# Altium schematic sheet FPGA_C.SchDoc: POLYSOME CRYPTO 01
size A3; Revision: V1; SheetNumber: 4; SheetTotal: 8; ProjectName: POLYSOME CRYPTO 01
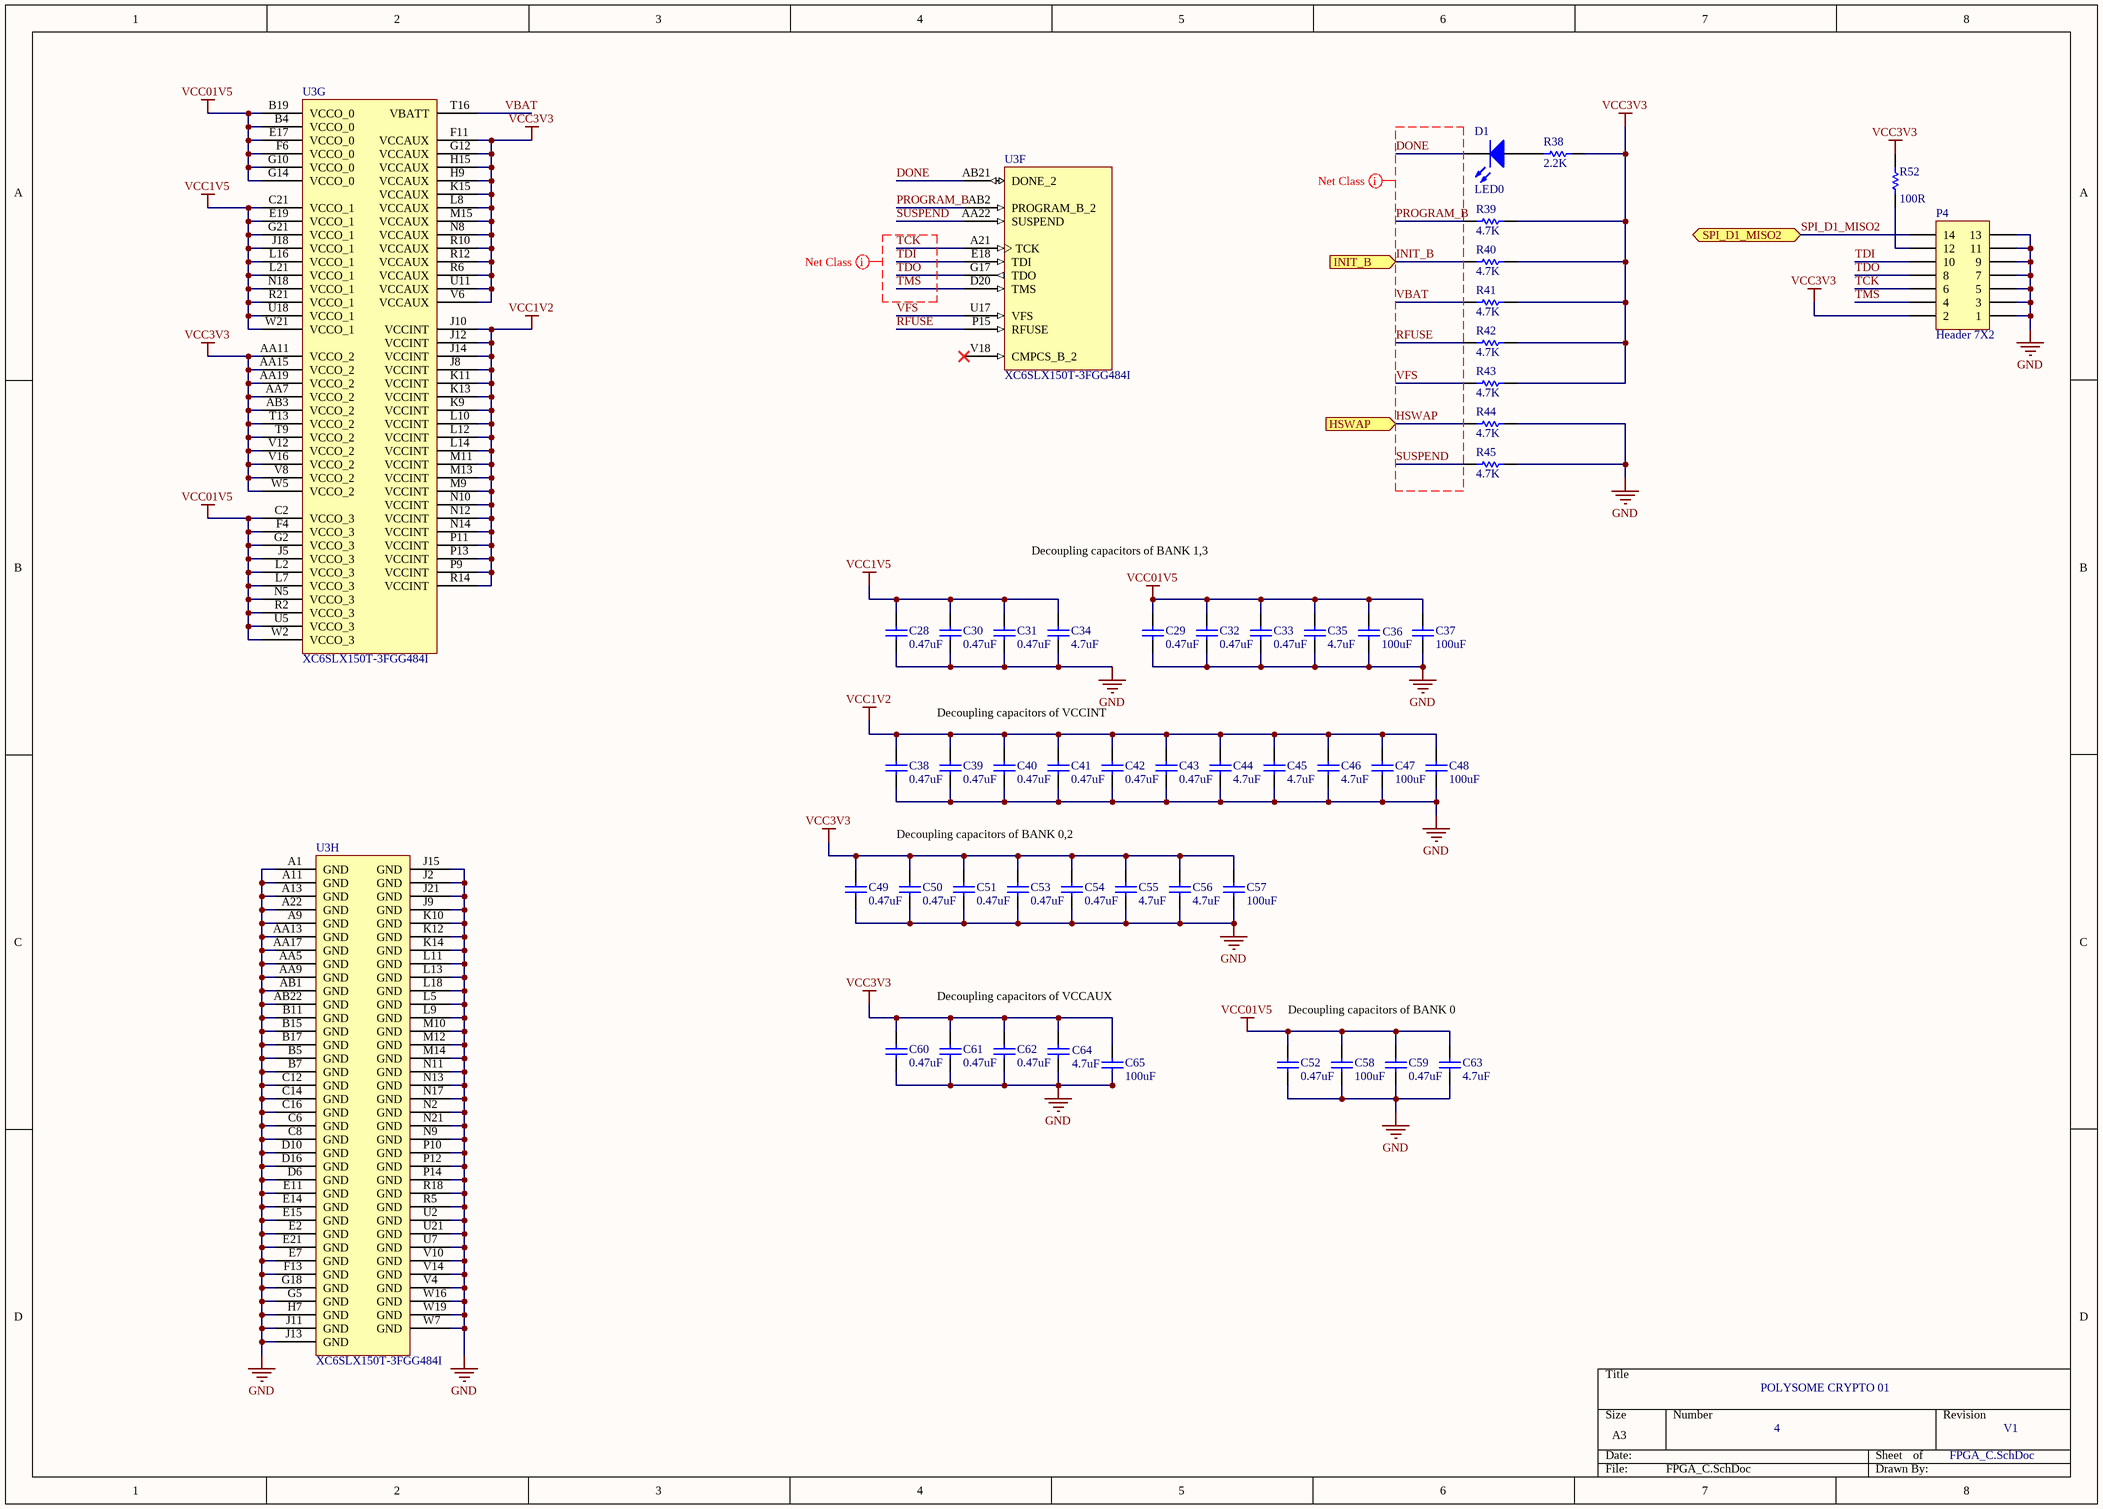
[diagram p0: FPGA_C.SchDoc]

## Parts
C28  value 0.47uF  [0402]  (hidden comment: Cap Semi)
C29  value 0.47uF  [0402]  (hidden comment: Cap Semi)
C30  value 0.47uF  [0402]  (hidden comment: Cap Semi)
C31  value 0.47uF  [0402]  (hidden comment: Cap Semi)
C32  value 0.47uF  [0402]  (hidden comment: Cap Semi)
C33  value 0.47uF  [0402]  (hidden comment: Cap Semi)
C34  value 4.7uF  [1608[0603]]  (hidden comment: Cap Semi)
C35  value 4.7uF  [1608[0603]]  (hidden comment: Cap Semi)
C36  value 100uF  [0402]  (hidden comment: Cap Semi)
C37  value 100uF  [0402]  (hidden comment: Cap Semi)
C38  value 0.47uF  [0402]  (hidden comment: Cap Semi)
C39  value 0.47uF  [0402]  (hidden comment: Cap Semi)
C40  value 0.47uF  [0402]  (hidden comment: Cap Semi)
C41  value 0.47uF  [0402]  (hidden comment: Cap Semi)
C42  value 0.47uF  [0402]  (hidden comment: Cap Semi)
C43  value 0.47uF  [0402]  (hidden comment: Cap Semi)
C44  value 4.7uF  [1608[0603]]  (hidden comment: Cap Semi)
C45  value 4.7uF  [1608[0603]]  (hidden comment: Cap Semi)
C46  value 4.7uF  [1608[0603]]  (hidden comment: Cap Semi)
C47  value 100uF  [0402]  (hidden comment: Cap Semi)
C48  value 100uF  [0402]  (hidden comment: Cap Semi)
C49  value 0.47uF  [0402]  (hidden comment: Cap Semi)
C50  value 0.47uF  [0402]  (hidden comment: Cap Semi)
C51  value 0.47uF  [0402]  (hidden comment: Cap Semi)
C52  value 0.47uF  [0402]  (hidden comment: Cap Semi)
C53  value 0.47uF  [0402]  (hidden comment: Cap Semi)
C54  value 0.47uF  [0402]  (hidden comment: Cap Semi)
C55  value 4.7uF  [1608[0603]]  (hidden comment: Cap Semi)
C56  value 4.7uF  [1608[0603]]  (hidden comment: Cap Semi)
C57  value 100uF  [0402]  (hidden comment: Cap Semi)
C58  value 100uF  [0402]  (hidden comment: Cap Semi)
C59  value 0.47uF  [0402]  (hidden comment: Cap Semi)
C60  value 0.47uF  [0402]  (hidden comment: Cap Semi)
C61  value 0.47uF  [0402]  (hidden comment: Cap Semi)
C62  value 0.47uF  [0402]  (hidden comment: Cap Semi)
C63  value 4.7uF  [1608[0603]]  (hidden comment: Cap Semi)
C64  value 4.7uF  [1608[0603]]  (hidden comment: Cap Semi)
C65  value 100uF  [C1206]  (hidden comment: Cap Semi)
D1  LED0  [1608[0603]]
P4  Header 7X2  [JTAG_WM9059CT-ND]
R38  value 2.2K  [0402]  (hidden comment: Res Semi)
R39  value 4.7K  [0402]  (hidden comment: Res Semi)
R40  value 4.7K  [0402]  (hidden comment: Res Semi)
R41  value 4.7K  [0402]  (hidden comment: Res Semi)
R42  value 4.7K  [0402]  (hidden comment: Res Semi)
R43  value 4.7K  [0402]  (hidden comment: Res Semi)
R44  value 4.7K  [0402]  (hidden comment: Res Semi)
R45  value 4.7K  [0402]  (hidden comment: Res Semi)
R52  value 100R  [0402]  (hidden comment: Res Semi)
U3  XC6SLX150T-3FGG484I  [FGG484]  (parts F,G,H of 8)

## Ports
HSWAP (in), INIT_B (in), SPI_D1_MISO2

## Nets
GND: C28.1 C29.1 C30.1 C31.1 C32.1 C33.1 C34.1 C35.1 C36.1 C37.1 C38.1 C39.1 C40.1 C41.1 C42.1 C43.1 C44.1 C45.1 C46.1 C47.1 C48.1 C49.1 C50.1 C51.1 C52.1 C53.1 C54.1 C55.1 C56.1 C57.1 C58.1 C59.1 C60.1 C61.1 C62.1 C63.1 C64.1 C65.1 P4.1 P4.3 P4.5 P4.7 P4.9 P4.11 P4.13 R44.1 R45.1 U3.A1(GND) U3.A9(GND) U3.A11(GND) U3.A13(GND) U3.A22(GND) U3.AA5(GND) U3.AA9(GND) U3.AA13(GND) U3.AA17(GND) U3.AB1(GND) U3.AB22(GND) U3.B5(GND) U3.B7(GND) U3.B11(GND) U3.B15(GND) U3.B17(GND) U3.C6(GND) U3.C8(GND) U3.C12(GND) U3.C14(GND) U3.C16(GND) U3.D6(GND) U3.D10(GND) U3.D16(GND) U3.E2(GND) U3.E7(GND) U3.E11(GND) U3.E14(GND) U3.E15(GND) U3.E21(GND) U3.F13(GND) U3.G5(GND) U3.G18(GND) U3.H7(GND) U3.J2(GND) U3.J9(GND) U3.J11(GND) U3.J13(GND) U3.J15(GND) U3.J21(GND) U3.K10(GND) U3.K12(GND) U3.K14(GND) U3.L5(GND) U3.L9(GND) U3.L11(GND) U3.L13(GND) U3.L18(GND) U3.M10(GND) U3.M12(GND) U3.M14(GND) U3.N2(GND) U3.N9(GND) U3.N11(GND) U3.N13(GND) U3.N17(GND) U3.N21(GND) U3.P10(GND) U3.P12(GND) U3.P14(GND) U3.R5(GND) U3.R18(GND) U3.U2(GND) U3.U7(GND) U3.U21(GND) U3.V4(GND) U3.V10(GND) U3.V14(GND) U3.W7(GND) U3.W16(GND) U3.W19(GND)
VCC1V2: C38.2 C39.2 C40.2 C41.2 C42.2 C43.2 C44.2 C45.2 C46.2 C47.2 C48.2 U3.J8(VCCINT) U3.J10(VCCINT) U3.J12(VCCINT) U3.J14(VCCINT) U3.K9(VCCINT) U3.K11(VCCINT) U3.K13(VCCINT) U3.L10(VCCINT) U3.L12(VCCINT) U3.L14(VCCINT) U3.M9(VCCINT) U3.M11(VCCINT) U3.M13(VCCINT) U3.N10(VCCINT) U3.N12(VCCINT) U3.N14(VCCINT) U3.P9(VCCINT) U3.P11(VCCINT) U3.P13(VCCINT) U3.R14(VCCINT)
VCC01V5: C29.2 C32.2 C33.2 C35.2 C36.2 C37.2 C52.2 C58.2 C59.2 C63.2 U3.B4(VCCO_0) U3.B19(VCCO_0) U3.C2(VCCO_3) U3.E17(VCCO_0) U3.F4(VCCO_3) U3.F6(VCCO_0) U3.G2(VCCO_3) U3.G10(VCCO_0) U3.G14(VCCO_0) U3.J5(VCCO_3) U3.L2(VCCO_3) U3.L7(VCCO_3) U3.N5(VCCO_3) U3.R2(VCCO_3) U3.U5(VCCO_3) U3.W2(VCCO_3)
VCC1V5: C28.2 C30.2 C31.2 C34.2 U3.C21(VCCO_1) U3.E19(VCCO_1) U3.G21(VCCO_1) U3.J18(VCCO_1) U3.L16(VCCO_1) U3.L21(VCCO_1) U3.N18(VCCO_1) U3.R21(VCCO_1) U3.U18(VCCO_1) U3.W21(VCCO_1)
VCC3V3: C49.2 C50.2 C51.2 C53.2 C54.2 C55.2 C56.2 C57.2 C60.2 C61.2 C62.2 C64.2 C65.2 P4.2 R38.1 R39.1 R40.1 R41.1 R42.1 R43.1 R52.2 U3.AA7(VCCO_2) U3.AA11(VCCO_2) U3.AA15(VCCO_2) U3.AA19(VCCO_2) U3.AB3(VCCO_2) U3.F11(VCCAUX) U3.G12(VCCAUX) U3.H9(VCCAUX) U3.H15(VCCAUX) U3.K15(VCCAUX) U3.L8(VCCAUX) U3.M15(VCCAUX) U3.N8(VCCAUX) U3.R6(VCCAUX) U3.R10(VCCAUX) U3.R12(VCCAUX) U3.T9(VCCO_2) U3.T13(VCCO_2) U3.U11(VCCAUX) U3.V6(VCCAUX) U3.V8(VCCO_2) U3.V12(VCCO_2) U3.V16(VCCO_2) U3.W5(VCCO_2)
DONE: D1.2(K) U3.AB21(DONE_2)
HSWAP: R44.2 ; port HSWAP
INIT_B: R40.2 ; port INIT_B
PROGRAM_B: R39.2 U3.AB2(PROGRAM_B_2)
RFUSE: R42.2 U3.P15(RFUSE)
SPI_D1_MISO2: P4.14 ; port SPI_D1_MISO2
SUSPEND: R45.2 U3.AA22(SUSPEND)
TCK: P4.6 U3.A21(TCK)
TDI: P4.10 U3.E18(TDI)
TDO: P4.8 U3.G17(TDO)
TMS: P4.4 U3.D20(TMS)
VBAT: R41.2 U3.T16(VBATT)
VFS: R43.2 U3.U17(VFS)
NetD1_1: D1.1(A) R38.2
NetP4_12: P4.12 R52.1

Not connected (* = marked no-connect by the designer): U3 V18(CMPCS_B_2)*

## Layout directives
net class JTAG: TCK, TDI, TDO, TMS
net class CONFIG: DONE, HSWAP, INIT_B, PROGRAM_B, RFUSE, SUSPEND, VBAT, VFS

## Notes on the sheet
- Decoupling capacitors of BANK 1,3
- Decoupling capacitors of VCCINT
- Decoupling capacitors of BANK 0,2
- Decoupling capacitors of VCCAUX
- Decoupling capacitors of BANK 0

## Library data of the parts
C28-C65 = Cap Semi: Capacitor (Semiconductor SIM Model); Published: 8-Jun-2000; LatestRevisionDate: 29-May-2009; LatestRevisionNote: IPC-7351 Footprint Added.; PackageReference: C1206; Publisher: Altium Limited; PackageDescription: Chip Capacitor
D1 = LED0: Typical INFRARED GaAs LED; Published: 8-Jun-2000; LatestRevisionDate: 08-Jul-2005; LatestRevisionNote: Mech Layer 1 removed.; PackageReference: LED-0; Publisher: Altium Limited; PackageDescription: LED; 2 Leads
P4 = Header 7X2: Header, 7-Pin, Dual row; LatestRevisionDate: 17-Jul-2002; LatestRevisionNote: Re-released for DXP Platform.; Publisher: Altium Limited
R38-R45 R52 = Res Semi: Semiconductor Resistor; Published: 8-Jun-2000; LatestRevisionDate: 17-Jul-2002; LatestRevisionNote: Re-released for DXP Platform.; PackageReference: AXIAL-0.5; Publisher: Altium Limited; PackageDescription: Axial Device, Thru-Hole; 2 Leads; 0.5 in Pin Spacing
U3 = XC6SLX150T-3FGG484I: Spartan-6 LXT 1.2V FPGA, 296 User I/Os, 484-Ball Fine-Pitch BGA (1.0mm Pitch), Speed Grade 3, Industrial Grade, Pb-Free; Published: 17-Nov-2009; DatasheetVersion: ver1.6, Nov-2010; PackageVersion: ver1.1, Dec-2008; PackageReference: FGG484; Publisher: Altium Limited; PackageDescription: 484-Ball Fine Pitch Ball Grid Array 1.00 mm Pitch (FGG484) - Pb-Free; Supplier 1: Digi-Key; Supplier Part Number 1: XC6SLX150T-3FGG484I-ND; Code_JEDEC: MS-034-AAJ-1; Code_IPC: BGA100P22X22-484; ComponentLink1Description: Manufacturer Link; ComponentLink1URL: http://www.xilinx.com; ComponentLink2Description: Spartan-6 Datasheet; ComponentLink2URL: http://www.xilinx.com/support/documentation/data_sheets/ds160.pdf; ComponentLink3Description: Spartan-6 Documents; ComponentLink3URL: http://www.xilinx.com/support/documentation/spartan-6.htm; ComponentLink4Description: Xilinx.com Home; ComponentLink4URL: http://www.xilinx.com